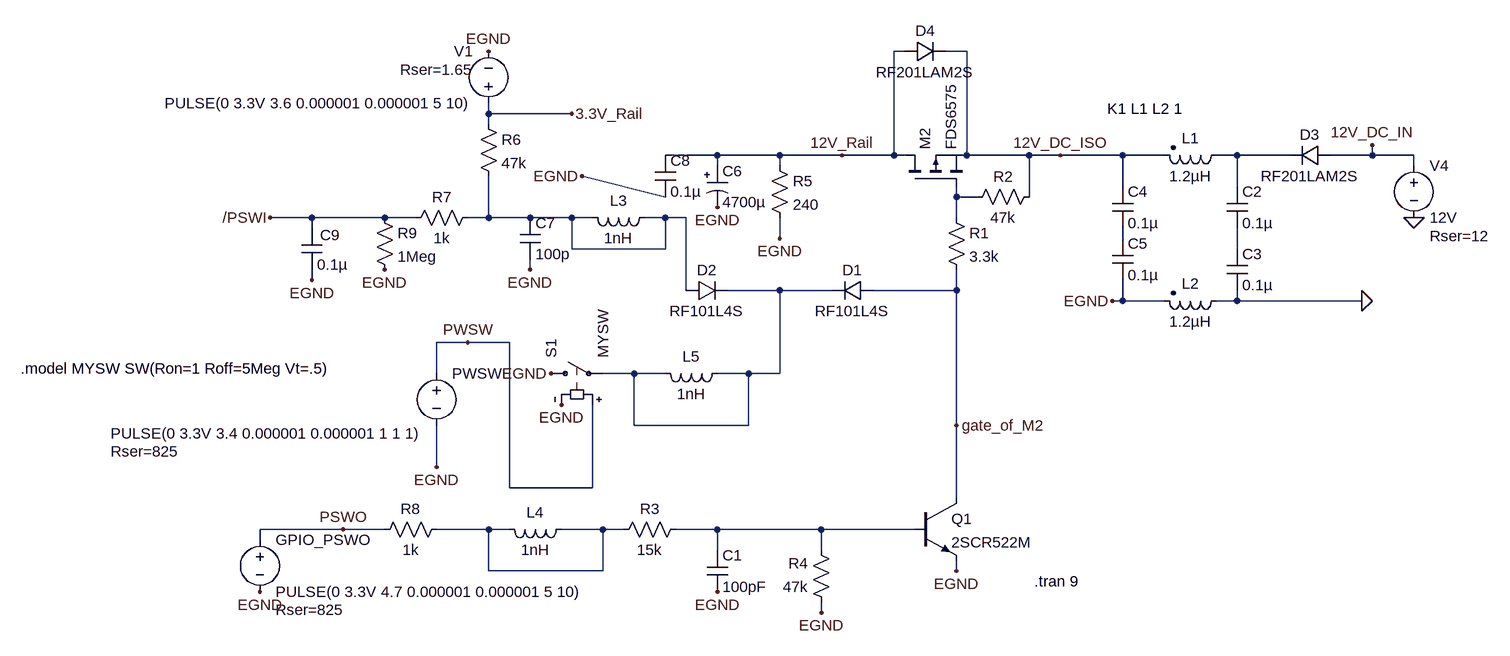
[diagram p0: schematic Power_Eswitch_Circuit_Analysis.asc]
Power_Eswitch_Circuit_Analysis.asc, the LTspice schematic file:
Version 4
SHEET 1 1464 752
WIRE 368 -224 352 -224
WIRE 464 -224 432 -224
WIRE -272 -128 -272 -144
WIRE -144 -128 -272 -128
WIRE -272 -112 -272 -128
WIRE 80 -64 0 -64
WIRE 176 -64 80 -64
WIRE 272 -64 176 -64
WIRE 352 -64 352 -224
WIRE 352 -64 272 -64
WIRE 368 -64 352 -64
WIRE 464 -64 464 -224
WIRE 560 -64 464 -64
WIRE 608 -64 560 -64
WIRE 704 -64 608 -64
WIRE 768 -64 704 -64
WIRE 880 -64 848 -64
WIRE 960 -64 880 -64
WIRE 1088 -64 1088 -80
WIRE 1088 -64 1024 -64
WIRE 1152 -64 1088 -64
WIRE 80 -48 80 -64
WIRE 176 -48 176 -64
WIRE 1152 -48 1152 -64
WIRE 704 -16 704 -64
WIRE 880 -16 880 -64
WIRE 0 0 -128 -32
WIRE 448 0 448 -16
WIRE 480 0 448 0
WIRE 560 0 560 -64
WIRE -544 32 -608 32
WIRE -432 32 -544 32
WIRE -384 32 -432 32
WIRE -272 32 -272 -32
WIRE -272 32 -304 32
WIRE -208 32 -272 32
WIRE -144 32 -208 32
WIRE -112 32 -144 32
WIRE 0 32 -32 32
WIRE 32 32 0 32
WIRE 448 32 448 0
WIRE -544 48 -544 32
WIRE 176 64 176 32
WIRE 704 64 704 48
WIRE -144 80 -144 32
WIRE 0 80 0 32
WIRE 0 80 -144 80
WIRE 880 80 880 48
WIRE -208 112 -208 96
WIRE -544 128 -544 112
WIRE 32 144 32 32
WIRE 176 144 96 144
WIRE 256 144 176 144
WIRE 448 144 448 112
WIRE 448 144 320 144
WIRE 704 160 704 128
WIRE 704 160 688 160
WIRE 768 160 704 160
WIRE 880 160 880 144
WIRE 880 160 848 160
WIRE 1072 160 880 160
WIRE -304 224 -352 224
WIRE -240 224 -304 224
WIRE -352 272 -352 224
WIRE -48 272 -96 272
WIRE 0 272 -48 272
WIRE 128 272 80 272
WIRE 176 272 176 144
WIRE 176 272 128 272
WIRE -48 352 -48 272
WIRE 128 352 128 272
WIRE 128 352 -48 352
WIRE 448 352 448 144
WIRE -352 416 -352 352
WIRE -240 448 -240 224
WIRE -112 448 -112 320
WIRE -112 448 -240 448
WIRE 448 464 448 352
WIRE -496 512 -624 512
WIRE -432 512 -496 512
WIRE -272 512 -352 512
WIRE -240 512 -272 512
WIRE -96 512 -160 512
WIRE -64 512 -96 512
WIRE 80 512 16 512
WIRE 240 512 80 512
WIRE 384 512 240 512
WIRE -624 528 -624 512
WIRE 80 544 80 512
WIRE 240 544 240 512
WIRE -272 576 -272 512
WIRE -96 576 -96 512
WIRE -96 576 -272 576
WIRE 448 576 448 560
WIRE 240 640 240 624
FLAG 1152 32 0
FLAG 272 -64 12V_Rail
FLAG 1072 160 0
FLAG 688 160 EGND
FLAG 448 576 EGND
FLAG 240 640 EGND
FLAG 80 608 EGND
FLAG -624 608 EGND
FLAG 80 16 EGND
FLAG 176 64 EGND
FLAG -160 320 EGND
FLAG -176 272 EGND
FLAG -608 32 /PSWI
FLAG -496 512 PSWO
FLAG -304 224 PWSW
FLAG 1088 -80 12V_DC_IN
FLAG 608 -64 12V_DC_ISO
FLAG -144 -128 3.3V_Rail
FLAG -272 -224 EGND
FLAG -208 112 EGND
FLAG -352 416 EGND
FLAG -432 112 EGND
FLAG 448 352 gate_of_M2
FLAG -128 -32 EGND
FLAG -544 128 EGND
SYMBOL voltage -624 512 R0
WINDOW 123 0 0 Left 0
WINDOW 39 24 124 Left 2
SYMATTR SpiceLine Rser=825
SYMATTR InstName GPIO_PSWO
SYMATTR Value PULSE(0 3.3V 4.7 0.000001 0.000001 5 10)
SYMBOL pmos 368 -16 R270
SYMATTR InstName M2
SYMATTR Value FDS6575
SYMBOL res 432 16 R0
SYMATTR InstName R1
SYMATTR Value 3.3k
SYMBOL voltage 1152 -64 R0
WINDOW 123 0 0 Left 0
WINDOW 39 24 124 Left 2
SYMATTR SpiceLine Rser=12
SYMATTR InstName V4
SYMATTR Value 12V
SYMBOL res 576 -16 R90
WINDOW 0 0 56 VBottom 2
WINDOW 3 32 56 VTop 2
SYMATTR InstName R2
SYMATTR Value 47k
SYMBOL npn 384 464 R0
SYMATTR InstName Q1
SYMATTR Value 2SCR522M
SYMBOL res 32 496 R90
WINDOW 0 0 56 VBottom 2
WINDOW 3 32 56 VTop 2
SYMATTR InstName R3
SYMATTR Value 15k
SYMBOL res 256 640 R180
WINDOW 0 36 76 Left 2
WINDOW 3 36 40 Left 2
SYMATTR InstName R4
SYMATTR Value 47k
SYMBOL cap 64 544 R0
SYMATTR InstName C1
SYMATTR Value 100pF
SYMBOL diode 1024 -80 R90
WINDOW 0 0 32 VBottom 2
WINDOW 3 32 32 VTop 2
SYMATTR InstName D3
SYMATTR Value RF201LAM2S
SYMBOL ind2 864 -80 R90
WINDOW 0 5 56 VBottom 2
WINDOW 3 32 56 VTop 2
SYMATTR InstName L1
SYMATTR Value 1.2µH
SYMATTR Type ind
SYMATTR SpiceLine Ipk=2
SYMBOL ind2 864 144 R90
WINDOW 0 5 56 VBottom 2
WINDOW 3 32 56 VTop 2
SYMATTR InstName L2
SYMATTR Value 1.2µH
SYMATTR Type ind
SYMATTR SpiceLine Ipk=2
SYMBOL cap 864 -16 R0
SYMATTR InstName C2
SYMATTR Value 0.1µ
SYMATTR SpiceLine V=25 Irms=0 Rser=0.037 Lser=674p mfg="Würth Elektronik" pn="885012210008 WCAP-CSGP 1812" type="X7R"
SYMBOL cap 864 80 R0
SYMATTR InstName C3
SYMATTR Value 0.1µ
SYMATTR SpiceLine V=25 Irms=0 Rser=0.037 Lser=674p mfg="Würth Elektronik" pn="885012210008 WCAP-CSGP 1812" type="X7R"
SYMBOL cap 688 -16 R0
SYMATTR InstName C4
SYMATTR Value 0.1µ
SYMATTR SpiceLine V=25 Irms=0 Rser=0.037 Lser=674p mfg="Würth Elektronik" pn="885012210008 WCAP-CSGP 1812" type="X7R"
SYMBOL cap 688 64 R0
SYMATTR InstName C5
SYMATTR Value 0.1µ
SYMATTR SpiceLine V=25 Irms=0 Rser=0.037 Lser=674p mfg="Würth Elektronik" pn="885012210008 WCAP-CSGP 1812" type="X7R"
SYMBOL voltage -352 256 R0
WINDOW 123 0 0 Left 0
WINDOW 39 -502 136 Left 2
WINDOW 3 -502 108 Left 2
SYMATTR SpiceLine Rser=825
SYMATTR InstName PWSW
SYMATTR Value PULSE(0 3.3V 3.4 0.000001 0.000001 1 1 1)
SYMBOL sw -192 272 R270
SYMATTR InstName S1
SYMATTR Value MYSW
SYMBOL res 160 -64 R0
SYMATTR InstName R5
SYMATTR Value 240
SYMBOL polcap 64 -48 R0
WINDOW 3 24 56 Left 2
SYMATTR InstName C6
SYMATTR Value 4700µ
SYMATTR Description Capacitor
SYMATTR Type cap
SYMATTR SpiceLine V=25 Irms=1.78 Rser=0.0333 Lser=19.4n mfg="Würth Elektronik" pn="860020480026 WCAP-ATG5 16x35,5" type="Al electrolytic"
SYMBOL diode 368 -208 R270
WINDOW 0 32 32 VTop 2
WINDOW 3 0 32 VBottom 2
SYMATTR InstName D4
SYMATTR Value RF201LAM2S
SYMBOL diode 32 160 R270
WINDOW 0 32 32 VTop 2
WINDOW 3 0 32 VBottom 2
SYMATTR InstName D2
SYMATTR Value RF101L4S
SYMBOL res -288 -128 R0
SYMATTR InstName R6
SYMATTR Value 47k
SYMBOL res -288 16 R90
WINDOW 0 0 56 VBottom 2
WINDOW 3 32 56 VTop 2
SYMATTR InstName R7
SYMATTR Value 1k
SYMBOL voltage -272 -128 R180
WINDOW 0 24 96 Left 2
WINDOW 3 24 16 Left 2
WINDOW 123 0 0 Left 0
WINDOW 39 24 68 Left 2
SYMATTR InstName V1
SYMATTR Value PULSE(0 3.3V 3.6 0.000001 0.000001 5 10)
SYMATTR SpiceLine Rser=1.65
SYMBOL cap -224 32 R0
SYMATTR InstName C7
SYMATTR Value 100p
SYMATTR SpiceLine V=50 Irms=0 Rser=0.8825 Lser=264p mfg="Würth Elektronik" pn="885012207080 WCAP-CSGP 0805" type="X7R"
SYMBOL ind -16 16 R90
WINDOW 0 5 56 VBottom 2
WINDOW 3 32 56 VTop 2
SYMATTR InstName L3
SYMATTR Value 1nH
SYMBOL res -336 496 R90
WINDOW 0 0 56 VBottom 2
WINDOW 3 32 56 VTop 2
SYMATTR InstName R8
SYMATTR Value 1k
SYMBOL ind -144 496 R90
WINDOW 0 5 56 VBottom 2
WINDOW 3 32 56 VTop 2
SYMATTR InstName L4
SYMATTR Value 1nH
SYMBOL ind 96 256 R90
WINDOW 0 5 56 VBottom 2
WINDOW 3 32 56 VTop 2
SYMATTR InstName L5
SYMATTR Value 1nH
SYMBOL res -448 16 R0
SYMATTR InstName R9
SYMATTR Value 1Meg
SYMBOL diode 320 128 R90
WINDOW 0 0 32 VBottom 2
WINDOW 3 32 32 VTop 2
SYMATTR InstName D1
SYMATTR Value RF101L4S
SYMBOL cap -16 -64 R0
SYMATTR InstName C8
SYMATTR Value 0.1µ
SYMATTR SpiceLine V=25 Irms=0 Rser=0.037 Lser=674p mfg="Würth Elektronik" pn="885012210008 WCAP-CSGP 1812" type="X7R"
SYMBOL cap -560 48 R0
WINDOW 0 29 11 Left 2
SYMATTR InstName C9
SYMATTR Value 0.1µ
SYMATTR SpiceLine V=50 Irms=0 Rser=0.033 Lser=600p mfg="Würth Elektronik" pn="885012205092 WCAP-CSGP 0402" type="X7R"
TEXT 568 592 Left 2 !.tran 9
TEXT 680 -136 Left 2 !K1 L1 L2 1
TEXT -992 264 Left 2 !.model MYSW SW(Ron=1 Roff=5Meg Vt=.5)

The netlist it stands for:
* Power_Eswitch_Circuit_Analysis.asc
V§GPIO_PSWO PSWO EGND PULSE(0 3.3V 4.7 0.000001 0.000001 5 10) Rser=825
M2 12V_Rail N002 12V_DC_ISO 12V_DC_ISO FDS6575
R1 N002 gate_of_M2 3.3k
V4 12V_DC_IN 0 12V Rser=12
R2 12V_DC_ISO N002 47k
Q1 gate_of_M2 N008 EGND 0 2SCR522M
R3 N008 N007 15k
R4 EGND N008 47k
C1 N008 EGND 100pF
D3 12V_DC_IN N001 RF201LAM2S
L1 N001 12V_DC_ISO 1.2µH Ipk=2
L2 0 EGND 1.2µH Ipk=2
C2 N001 N005 0.1µ V=25 Irms=0 Rser=0.037 Lser=674p mfg="Würth Elektronik" pn="885012210008 WCAP-CSGP 1812" type="X7R"
C3 N005 0 0.1µ V=25 Irms=0 Rser=0.037 Lser=674p mfg="Würth Elektronik" pn="885012210008 WCAP-CSGP 1812" type="X7R"
C4 12V_DC_ISO N004 0.1µ V=25 Irms=0 Rser=0.037 Lser=674p mfg="Würth Elektronik" pn="885012210008 WCAP-CSGP 1812" type="X7R"
C5 N004 EGND 0.1µ V=25 Irms=0 Rser=0.037 Lser=674p mfg="Würth Elektronik" pn="885012210008 WCAP-CSGP 1812" type="X7R"
V§PWSW PWSW EGND PULSE(0 3.3V 3.4 0.000001 0.000001 1 1 1) Rser=825
S1 EGND N006 PWSW EGND MYSW
R5 12V_Rail EGND 240
C6 12V_Rail EGND 4700µ V=25 Irms=1.78 Rser=0.0333 Lser=19.4n mfg="Würth Elektronik" pn="860020480026 WCAP-ATG5 16x35,5" type="Al electrolytic"
D4 12V_Rail 12V_DC_ISO RF201LAM2S
D2 N003 N006 RF101L4S
R6 3.3V_Rail N003 47k
R7 N003 /PSWI 1k
V1 3.3V_Rail EGND PULSE(0 3.3V 3.6 0.000001 0.000001 5 10) Rser=1.65
C7 N003 EGND 100p V=50 Irms=0 Rser=0.8825 Lser=264p mfg="Würth Elektronik" pn="885012207080 WCAP-CSGP 0805" type="X7R"
L3 N003 N003 1nH
R8 N007 PSWO 1k
L4 N007 N007 1nH
L5 N006 N006 1nH
R9 /PSWI EGND 1Meg
D1 gate_of_M2 N006 RF101L4S
C8 12V_Rail EGND 0.1µ V=25 Irms=0 Rser=0.037 Lser=674p mfg="Würth Elektronik" pn="885012210008 WCAP-CSGP 1812" type="X7R"
C9 /PSWI EGND 0.1µ V=50 Irms=0 Rser=0.033 Lser=600p mfg="Würth Elektronik" pn="885012205092 WCAP-CSGP 0402" type="X7R"
.model D D
.lib standard.dio
.model NPN NPN
.model PNP PNP
.lib standard.bjt
.model NMOS NMOS
.model PMOS PMOS
.lib standard.mos
.tran 9
K1 L1 L2 1
.model MYSW SW(Ron=1 Roff=5Meg Vt=.5)
.backanno
.end